# Altium schematic sheet ARDUINO_GPIO.SchDoc: MISKO 3.0
size A4; Date: 19.9.2021; Author: AMADEJ PAPEŽ; SheetNumber: 1; SheetTotal: 1; Version: V8; SheetTitle: ARDUINO_GPIO
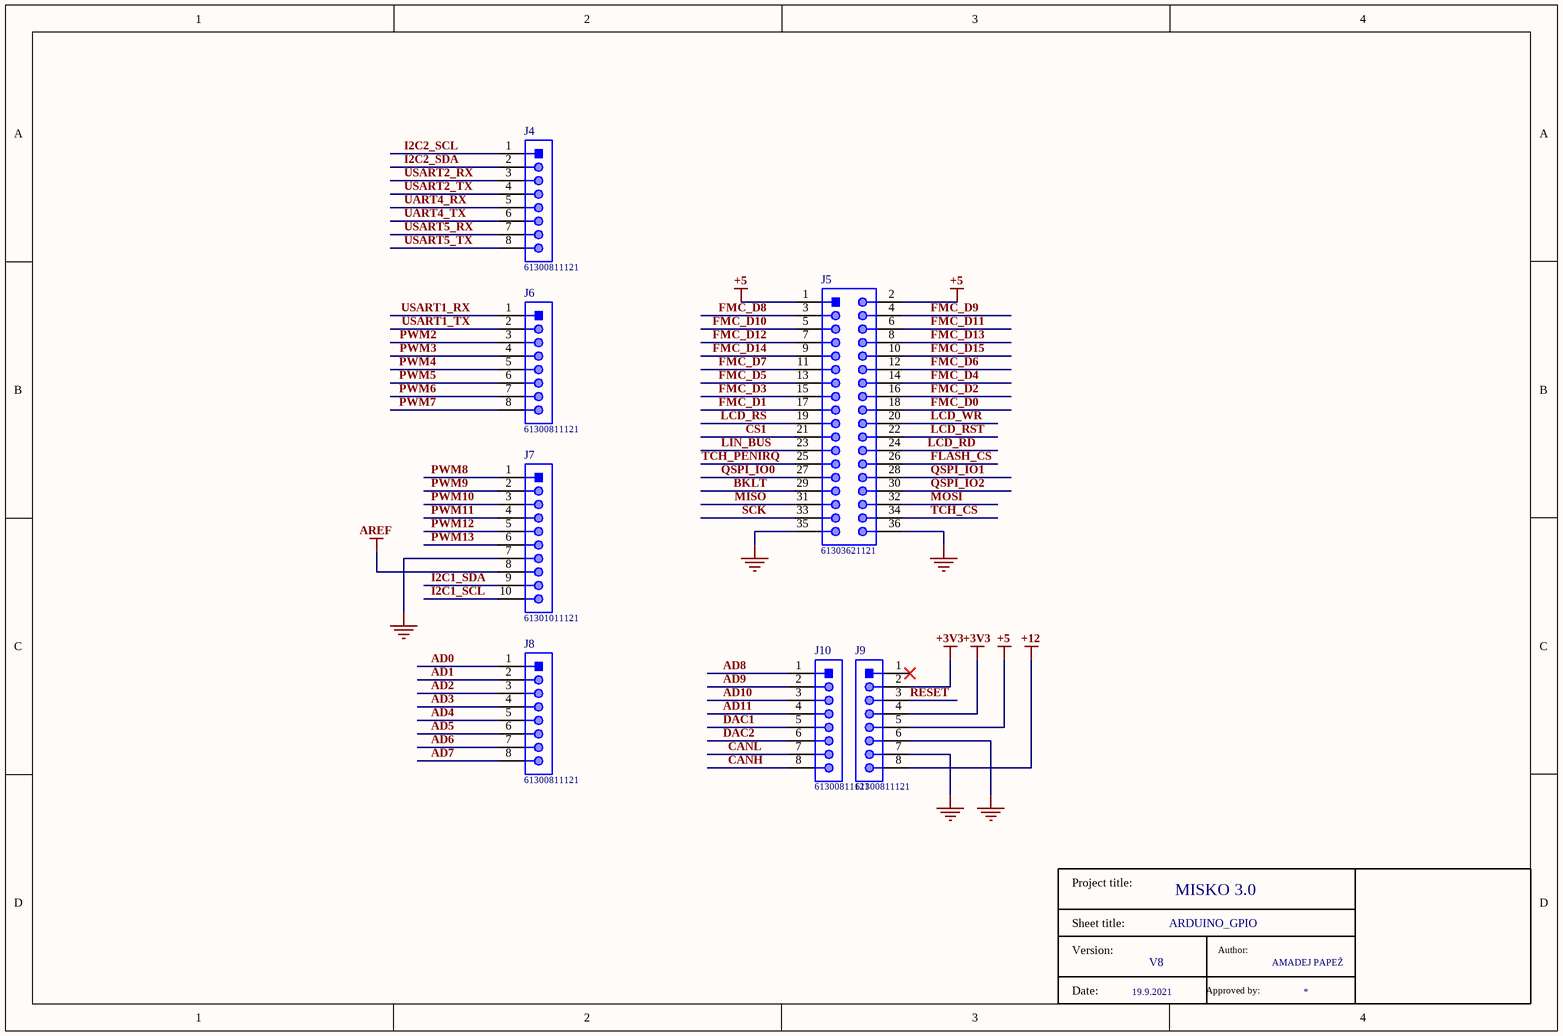
[diagram p0: ARDUINO_GPIO.SchDoc]

## Parts
J4  61300811121  [61300811121]
J5  61303621121  [61303621121]
J6  61300811121  [61300811121]
J7  61301011121  [61301011121]
J8  61300811121  [61300811121]
J9  61300811121  [61300811121]
J10  61300811121  [61300811121]
T6  (no value)

## Nets
+3V3: J9.2 J9.4
+5: J5.1 J5.2 J9.5
+12: J9.8
AREF: J7.8
GND: J5.35 J5.36 J7.7 J9.6 J9.7
AD0: J8.1
AD1: J8.2
AD2: J8.3
AD3: J8.4
AD4: J8.5
AD5: J8.6
AD6: J8.7
AD7: J8.8
AD8: J10.1
AD9: J10.2
AD10: J10.3
AD11: J10.4
BKLT: J5.29
CANH: J10.8
CANL: J10.7
CS1: J5.21
DAC1: J10.5
DAC2: J10.6
FLASH_CS: J5.26
FMC_D0: J5.18
FMC_D1: J5.17
FMC_D2: J5.16
FMC_D3: J5.15
FMC_D4: J5.14
FMC_D5: J5.13
FMC_D6: J5.12
FMC_D7: J5.11
FMC_D8: J5.3
FMC_D9: J5.4
FMC_D10: J5.5
FMC_D11: J5.6
FMC_D12: J5.7
FMC_D13: J5.8
FMC_D14: J5.9
FMC_D15: J5.10
I2C1_SCL: J7.10
I2C1_SDA: J7.9
I2C2_SCL: J4.1
I2C2_SDA: J4.2
LCD_RD: J5.24
LCD_RS: J5.19
LCD_RST: J5.22
LCD_WR: J5.20
LIN_BUS: J5.23
MISO: J5.31
MOSI: J5.32
PWM2: J6.3
PWM3: J6.4
PWM4: J6.5
PWM5: J6.6
PWM6: J6.7
PWM7: J6.8
PWM8: J7.1
PWM9: J7.2
PWM10: J7.3
PWM11: J7.4
PWM12: J7.5
PWM13: J7.6
QSPI_IO0: J5.27
QSPI_IO1: J5.28
QSPI_IO2: J5.30
RESET: J9.3
SCK: J5.33
TCH_CS: J5.34
TCH_PENIRQ: J5.25
UART4_RX: J4.5
UART4_TX: J4.6
USART1_RX: J6.1
USART1_TX: J6.2
USART2_RX: J4.3
USART2_TX: J4.4
USART5_RX: J4.7
USART5_TX: J4.8

Not connected (* = marked no-connect by the designer): J9 1*

## Notes on the sheet
- (in symbol Title block) Project title:; Sheet title:; Version:; Author:; Date:; Approved by:

## Library data of the parts
J4 J6 J8-J10 = CMP-1502-01076-1: THT Vertical Pin Header WR-PHD, Pitch 2.54 mm, Single Row, 8 pins; Manufacturer: Wurth Elektronik; Rated Current: 3A; Pin Number: 8; Working Voltage: 250VAC; Gender: Male; Contact Resistance: 20mOhm; Pitch: 2.54mm; Withstanding Voltage: 500VAC; Publisher: WurthElektronik; Operating Temperature: -40to105degC; Orientation: Vertical; Row Number: Single; Part Number: 61300811121; Package Reference: 61300811121; Mounting Technology: THT; Packaging: Bag; Manufacturer URL: http://www.we-online.de; Datasheet URL: https://katalog.we-online.de/em/datasheet/6130xx11121.pdf
J5 = CMP-1502-01131-1: THT Vertical Pin Header WR-PHD, Pitch 2.54 mm, Dual Row, 36 pins; Manufacturer: Wurth Elektronik; Gender: Male; Working Voltage: 250VAC; Pin Number: 36; Pitch: 2.54mm; Contact Resistance: 20mOhm; Rated Current: 3A; Withstanding Voltage: 500VAC; Row Number: Dual; Package Reference: 61303621121; Publisher: WurthElektronik; Datasheet URL: https://katalog.we-online.de/em/datasheet/6130xx21121.pdf; Part Number: 61303621121; Mounting Technology: THT; Manufacturer URL: http://www.we-online.de; Packaging: Bag; Orientation: Vertical; Operating Temperature: -40to105degC
J7 = CMP-1502-01082-1: THT Vertical Pin Header WR-PHD, Pitch 2.54 mm, Single Row, 10 pins; Manufacturer: Wurth Elektronik; Contact Resistance: 20mOhm; Rated Current: 3A; Pitch: 2.54mm; Gender: Male; Pin Number: 10; Working Voltage: 250VAC; Withstanding Voltage: 500VAC; Manufacturer URL: http://www.we-online.de; Operating Temperature: -40to105degC; Datasheet URL: https://katalog.we-online.de/em/datasheet/6130xx11121.pdf; Row Number: Single; Orientation: Vertical; Part Number: 61301011121; Packaging: Bag; Package Reference: 61301011121; Mounting Technology: THT; Publisher: WurthElektronik
T6 = Title block